# EAGLE design HIH-5030-v10 (EAGLE 6.2)
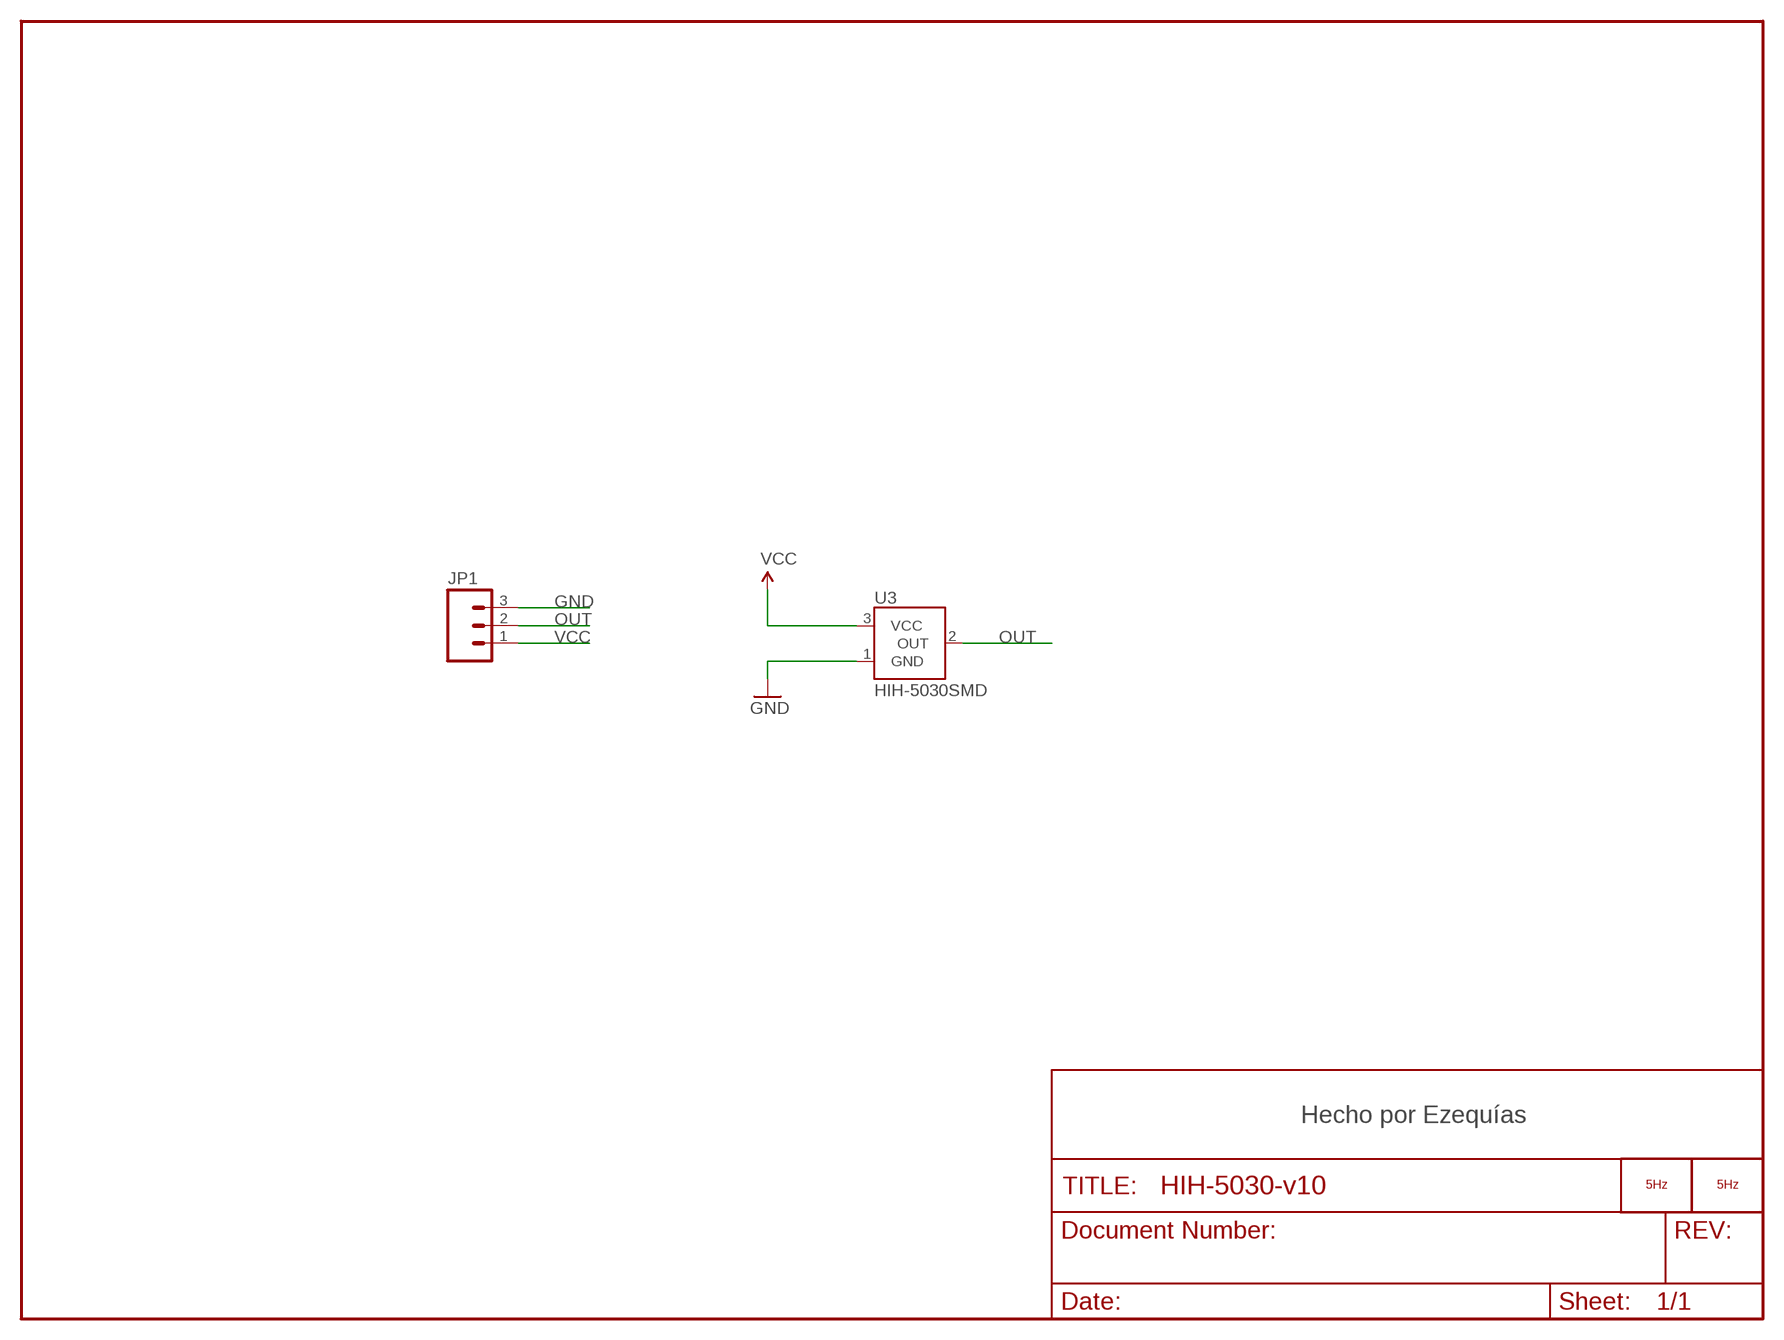
[diagram p0: schematic, sheet 1]

## Parts
JP1  M03PTH  [1X03]
LOGO1  LOGO_5HZ_H_5MM  [5HZ_LOGO_H_5MM]
LOGO2  LOGO_5HZ_H_COOPER_10MM  [5HZ_LOGO_H_COOPER_10MM]
U3  HIH-5030SMD  [HIH-5030]

## Nets
GND: JP1.3 U3.1(GND)
OUT: JP1.2 U3.2(OUT)
VCC: JP1.1 U3.3(VCC)

## Notes on the sheet
- Hecho por Ezequías

## Library data of the parts
JP1 = SparkFun:M03: Header 3 Standard 3-pin 0.1" header. Use with straight break away headers (SKU : PRT-00116), right angle break away headers (PRT-00553), swiss pins (PRT-00743), machine pins (PRT-00117), and female headers (PRT-00115). Molex polarized connector foot print use with SKU : PRT-08232 with associated crimp pins and housings.
LOGO1 LOGO2 = 5hz-electronica:LOGO_5HZ: Logotipo 5Hz "según Pedro"
U3 = 5hz-electronica:HIH-5030: Humidity Sensor

## Net classes
0 default: width 0.203 mm
1 vcc: width 0.305 mm
2 gnd: width 0.254 mm

## Board
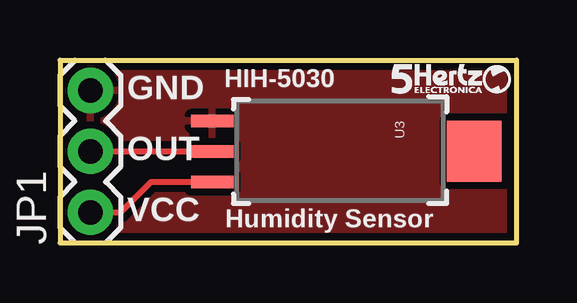
[diagram p1: board, top side]
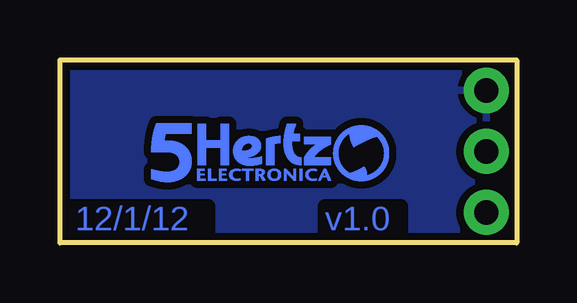
[diagram p2: board, bottom side, seen from below]

Size 19.05 x 7.62 mm. Coordinates in mm from the lower left corner, seen from the top.
Outline: 19.05,0 19.05,7.62 0,7.62 0,0 19.05,0
Copper layers (1*16): Top 0.035mm / dielectric 1.5mm / Bottom 0.035mm
Design rules "SparkFun": minimum track width 8mil, minimum drill 20mil, track to track 8mil, track to pad 8mil, pad to pad 8mil, via to via 8mil, smd to smd 8mil, copper to edge 10mil, drill to drill 8mil, minimum pad ring 12mil, minimum via ring 10mil, stop-mask expansion 4mil, vias tented up to drill 20mil, thermal gap 10mil

### Footprints (pad centres in the part's own frame; a part is rotated, then mirrored left to right if it is on the bottom)
1X03 = drill 1.016 pad 1.88 round: 1 0,0; 2 2.54,0; 3 5.08,0
HIH-5030 = smd 0.508 x 1.778: 1 -1.27,-5.08; 2 0,-5.08; 3 1.27,-5.08 | smd 2.54 x 2.286: NC 0,5.842

### Placement (x,y rotation side)
JP1  1.27,1.27 90 top
LOGO1  13.84,6.22 0 top
LOGO2  15.24,2.54 0 bottom
U3  11.43,3.81 270 top

### Tracks (layer width: path | path; a pad name or v marks a point on that pad's centre or on a via)
GND
  pour Bottom (isolate 0.305): 0,7.62 19.05,7.62 19.05,0 0,0
  pour Top (isolate 0.305): 0,7.62 19.05,7.62 19.05,0 0,0
OUT
  Top 0.254: JP1.2 U3.2
VCC
  Top 0.254: U3.3 3.81,2.54 2.54,1.27 JP1.1

### Text on the board
Bottom: v1.0 | 12/1/12
tPlace: HIH-5030 | GND | OUT | VCC | Humidity Sensor